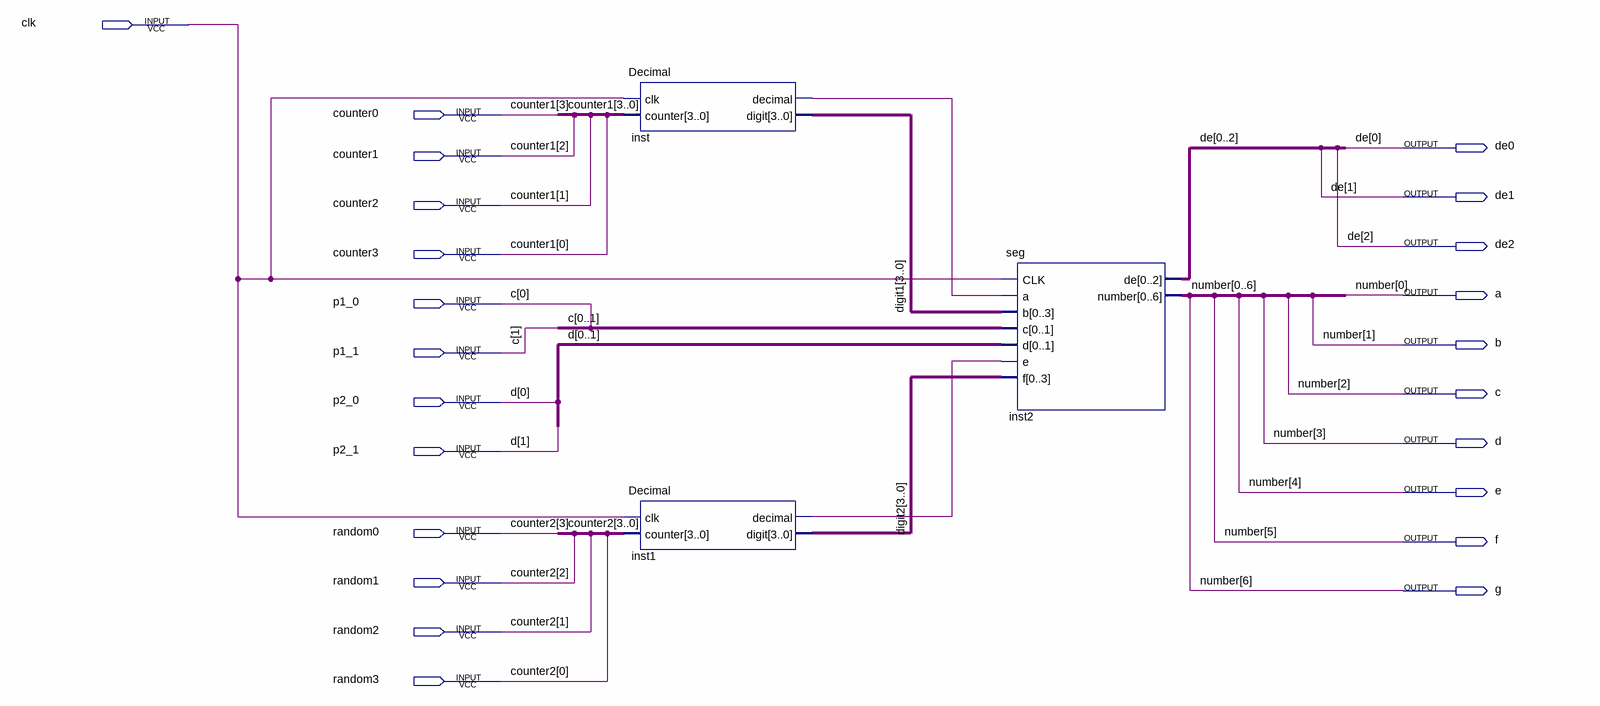
[diagram p0: schematic sheet]
// Quartus schematic SegController.bdf as structural Verilog: 3 symbols, 23 pins
module SegController (
  input  clk,
  input  counter0,
  input  counter1,
  input  counter2,
  input  counter3,
  input  p1_0,
  input  p1_1,
  input  p2_0,
  input  p2_1,
  input  random0,
  input  random1,
  input  random2,
  input  random3,
  output de0,
  output de1,
  output de2,
  output a,
  output b,
  output c,
  output d,
  output e,
  output f,
  output g
);

  wire inst1_decimal, inst_decimal;
  wire [3:0] digit1, digit2;

  Decimal inst (.clk(clk), .counter({counter0, counter1, counter2, counter3}), .decimal(inst_decimal), .digit(digit1));
  Decimal inst1 (.clk(clk), .counter({random0, random1, random2, random3}), .decimal(inst1_decimal), .digit(digit2));
  seg inst2 (
    .CLK(clk), .a(inst_decimal), .b(digit1), .c({p1_0, p1_1}), .d({p2_0, p2_1}), .e(inst1_decimal),
    .f(digit2), .de({de0, de1, de2}), .number({a, b, c, d, e, f, g}));

  // Other names for the same wires on the sheet: c[1:0] = {p1_1, p1_0};
  //   counter1[3:0] = {counter0, counter1, counter2, counter3}; counter2[3:0] = {random0, random1, random2, random3};
  //   d[1:0] = {p2_1, p2_0}; number[6:0] = {g, f, e, d, c, b, a}
endmodule
